# EAGLE design Magic_PCB_Pro_Micro (EAGLE 9.6.2)
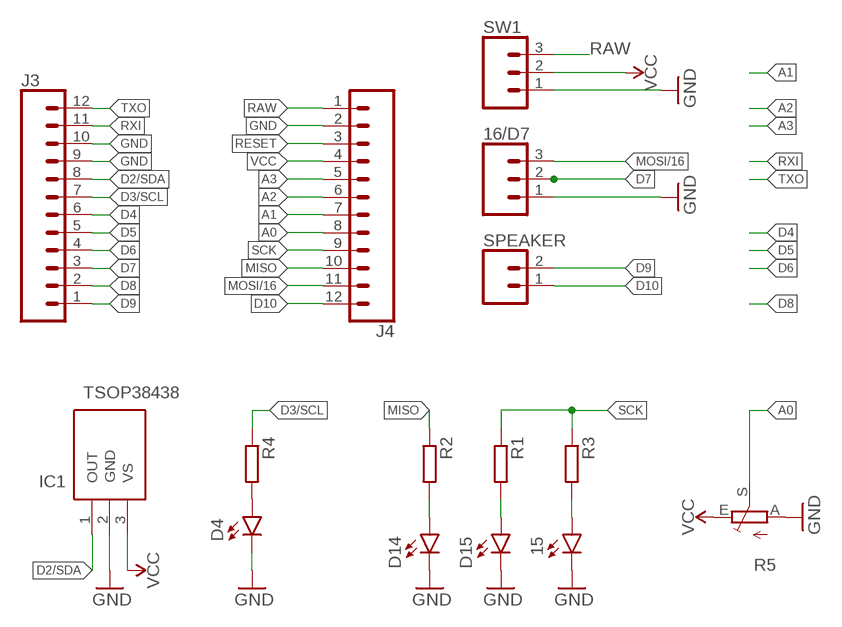
[diagram p0: schematic, sheet 1]

## Parts
15  GREEN  LEDSFH482  [SFH482]
16/D7  CONN_03  [1X03]
D4  GREEN  LEDSFH482  [SFH482]
D14  GREEN  LEDSFH482  [SFH482]
D15  Yellow  LEDSFH482  [SFH482]
IC1  TSOP38438  [TSOP38238]
J3  CONN_12LONGPADS  [1X12_LONGPADS]
J4  CONN_12LONGPADS  [1X12_LONGPADS]
R1  160  R-EU_R3216W  [R3216W]
R2  160  R-EU_R3216W  [R3216W]
R3  160  R-EU_R3216W  [R3216W]
R4  68  R-EU_R3216W  [R3216W]
R5  TRIM_EU-S64W  [S64W]
SPEAKER  CONN_02  [1X02]
SW1  CONN_03  [1X03]

## Nets
A0: J4.8 R5.S
A1: J4.7
A2: J4.6
A3: J4.5
D2/SDA: IC1.1(OUT) J3.8
D3/SCL: J3.7 R4.1
D4: J3.6
D5: J3.5
D6: J3.4
D7: 16/D7.2 J3.3
D8: J3.2
D9: J3.1 SPEAKER.2
D10: J4.12 SPEAKER.1
GND: 15.K(C) 16/D7.1 D4.K(C) D14.K(C) D15.K(C) IC1.2(GND) J3.9 J3.10 J4.2 R5.A SW1.1
MISO: J4.10 R2.1
MOSI/16: 16/D7.3 J4.11
N$1: D14.A R2.2
N$2: D15.A R1.2
N$3: 15.A R3.2
N$4: D4.A R4.2
RAW [vcc]: J4.1 SW1.3
RESET: J4.3
RXI: J3.11
SCK: J4.9 R1.1 R3.1
TXO: J3.12
VCC: IC1.3(VS) J4.4 R5.E SW1.2

## Library data of the parts
15 D4 D14 D15 = led:LED: LED OSRAM: - CHIPLED LG R971, LG N971, LY N971, LG Q971, LY Q971, LO R971, LY R971 LH N974, LH R974 LS Q976, LO Q976, LY Q976 LO Q996 - Hyper CHIPLED LW Q18S LB Q993, LB Q99A, LB R99A - SideLED LS A670, LO A670, LY A670, LG A670, LP A670 LB A673, LV A673, LT A673, LW A673 LH A674 LY A675 LS A676, LA A676, LO A676, LY A676, LW A676 LS A679, LY A679, LG A679 - Hyper Micro SIDELED® LS Y876, LA Y876, LO Y876, LY Y876 LT Y87S - SmartLED LW L88C, LW L88S LB L89C, LB L89S, LG L890 LS L89K, LO L89K, LY L89K LS L896, LA L896, LO L896, LY L896 - TOPLED LS T670, LO T670, LY T670, LG T670, LP T670 LSG T670, LSP T670, LSY T670, LOP T670, LYG T670 LG T671, LOG T671, LSG T671 LB T673, LV T673, LT T673, LW T673 LH T674 LS T676, LA T676, LO T676, LY T676, LB T676, LH T676, LSB T676, LW T676 LB T67C, LV T67C, LT T67C, LS T67K, LO T67K, LY T67K, LW E67C LS E67B, LA E67B, LO E67B, LY E67B, LB E67C, LV E67C, LT E67C LW T67C LS T679, LY T679, LG T679 LS T770, LO T770, LY T770, LG T770, LP T770 LB T773, LV T773, LT T773, LW T773 LH T774 LS E675, LA E675, LY E675, LS T675 LS T776, LA T776, LO T776, LY T776, LB T776 LHGB T686 LT T68C, LB T68C - Hyper Mini TOPLED® LB M676 - Mini TOPLED Santana® LG M470 LS M47K, LO M47K, LY M47K Source: http://www.osram.convergy.de LUXEON: - LUMILED® LXK2-PW12-R00, LXK2-PW12-S00, LXK2-PW14-U00, LXK2-PW14-V00 LXK2-PM12-R00, LXK2-PM12-S00, LXK2-PM14-U00 LXK2-PE12-Q00, LXK2-PE12-R00, LXK2-PE12-S00, LXK2-PE14-T00, LXK2-PE14-U00 LXK2-PB12-K00, LXK2-PB12-L00, LXK2-PB12-M00, LXK2-PB14-N00, LXK2-PB14-P00, LXK2-PB14-Q00 LXK2-PR12-L00, LXK2-PR12-M00, LXK2-PR14-Q00, LXK2-PR14-R00 LXK2-PD12-Q00, LXK2-PD12-R00, LXK2-PD12-S00 LXK2-PH12-R00, LXK2-PH12-S00 LXK2-PL12-P00, LXK2-PL12-Q00, LXK2-PL12-R00 Source: www.luxeon.com KINGBRIGHT: KA-3528ASYC Source: www.kingbright.com
16/D7 SW1 = SparkFun-Connectors:CONN_03: Multi connection point. Often used as Generic Header-pin footprint for 0.1 inch spaced/style header connections On any of the 0.1 inch spaced packages, you can populate with these: Break Away Headers - Straight <https://www.sparkfun.com/products/116> (PRT-00116) Break Away Male Headers - Right Angle <https://www.sparkfun.com/products/553> (PRT-00553) Female Headers <https://www.sparkfun.com/products/115> (PRT-00115) Break Away Headers - Machine Pin <https://www.sparkfun.com/products/117> (PRT-00117) Break Away Female Headers - Swiss Machine Pin <https://www.sparkfun.com/products/743> (PRT-00743) Stackable Header - 3 Pin (Female, 0.1") <https://www.sparkfun.com/products/13875> (PRT-13875) For SCREWTERMINALS and SPRING TERMINALS visit here: Screw Terimnals on SparkFun.com <https://www.sparkfun.com/search/results?term=Screw+Terminals> (5mm/3.5mm/2.54mm spacing) This device is also useful as a general connection point to wire up your design to another part of your project. Our various solder wires solder well into these plated through hole pads. Hook-Up Wire - Assortment (Stranded, 22 AWG) <https://www.sparkfun.com/products/11375> (PRT-11375) Hook-Up Wire - Assortment (Solid Core, 22 AWG) <https://www.sparkfun.com/products/11367> (PRT-11367) View the entire wire category on our website here <https://www.sparkfun.com/categories/141> Special notes: Molex polarized connector foot print use with SKU : PRT-08232 with associated crimp pins and housings.
IC1 = TSOP38438:TSOP38438: IR Remote Receiver 38KHz 45m Source: Datasheet <http://www.vishay.com/docs/82491/tsop382.pdf>; ARROW_PART_NUMBER: TSOP38438; ARROW_PRICE-STOCK: https://www.arrow.com/en/products/tsop38438/vishay?region=nac; DESCRIPTION: IR Remote Receiver 38KHz 45m; HEIGHT: mm; MANUFACTURER_NAME: Vishay; MANUFACTURER_PART_NUMBER: TSOP38438; MOUSER_PART_NUMBER: 78-TSOP38438; MOUSER_PRICE-STOCK: https://www.mouser.co.uk/ProductDetail/Vishay-Semiconductors/TSOP38438/?qs=fbkhFuCHoTaKUNuf%2Fea2zA%3D%3D
J3 J4 = Castellated:CONN_12: Multi connection point. Often used as Generic Header-pin footprint for 0.1 inch spaced/style header connections On any of the 0.1 inch spaced packages, you can populate with these: Break Away Headers - Straight <https://www.sparkfun.com/products/116> (PRT-00116) Break Away Male Headers - Right Angle <https://www.sparkfun.com/products/553> (PRT-00553) Female Headers <https://www.sparkfun.com/products/115> (PRT-00115) Break Away Headers - Machine Pin <https://www.sparkfun.com/products/117> (PRT-00117) Break Away Female Headers - Swiss Machine Pin <https://www.sparkfun.com/products/743> (PRT-00743) For SCREWTERMINALS and SPRING TERMINALS visit here: Screw Terimnals on SparkFun.com <https://www.sparkfun.com/search/results?term=Screw+Terminals> (5mm/3.5mm/2.54mm spacing) This device is also useful as a general connection point to wire up your design to another part of your project. Our various solder wires solder well into these plated through hole pads. Hook-Up Wire - Assortment (Stranded, 22 AWG) <https://www.sparkfun.com/products/11375> (PRT-11375) Hook-Up Wire - Assortment (Solid Core, 22 AWG) <https://www.sparkfun.com/products/11367> (PRT-11367) View the entire wire category on our website here <https://www.sparkfun.com/categories/141> Special notes: Molex polarized connector foot print use with SKU : PRT-08231 with associated crimp pins and housings. 1MM SMD Version SKU: PRT-10208 NOTES ON THE VARIANTS LOCK and LOCK_LONGPADS... This footprint was designed to help hold the alignment of a through-hole component (i.e. 6-pin header) while soldering it into place. You may notice that each hole has been shifted either up or down by 0.005 of an inch from it's more standard position (which is a perfectly straight line). This slight alteration caused the pins (the squares in the middle) to touch the edges of the holes. Because they are alternating, it causes a "brace" to hold the component in place. 0.005 has proven to be the perfect amount of "off-center" position when using our standard breakaway headers. Although looks a little odd when you look at the bare footprint, once you have a header in there, the alteration is very hard to notice. Also,if you push a header all the way into place, it is covered up entirely on the bottom side.
R1-R4 = rcl:R-EU_: RESISTOR, European symbol; SPICEPREFIX: R
R5 = pot:TRIM_EU-: POTENTIOMETER
SPEAKER = SparkFun-Connectors:CONN_02: Multi connection point. Often used as Generic Header-pin footprint for 0.1 inch spaced/style header connections On any of the 0.1 inch spaced packages, you can populate with these: Break Away Headers - Straight <https://www.sparkfun.com/products/116> (PRT-00116) Break Away Male Headers - Right Angle <https://www.sparkfun.com/products/553> (PRT-00553) Female Headers <https://www.sparkfun.com/products/115> (PRT-00115) Break Away Headers - Machine Pin <https://www.sparkfun.com/products/117> (PRT-00117) Break Away Female Headers - Swiss Machine Pin <https://www.sparkfun.com/products/743> (PRT-00743) For SCREWTERMINALS and SPRING TERMINALS visit here: Screw Terimnals on SparkFun.com <https://www.sparkfun.com/search/results?term=Screw+Terminals> (5mm/3.5mm/2.54mm spacing) This device is also useful as a general connection point to wire up your design to another part of your project. Our various solder wires solder well into these plated through hole pads. Hook-Up Wire - Assortment (Stranded, 22 AWG) <https://www.sparkfun.com/products/11375> (PRT-11375) Hook-Up Wire - Assortment (Solid Core, 22 AWG) <https://www.sparkfun.com/products/11367> (PRT-11367) View the entire wire category on our website here <https://www.sparkfun.com/categories/141> Special notes: Molex polarized connector foot print use with: PRT-08233 with associated crimp pins and housings. 2.54_SCREWTERM for use with PRT-10571. 3.5mm Screw Terminal footprints for PRT-08084 5mm Screw Terminal footprints for use with PRT-08432

## Board
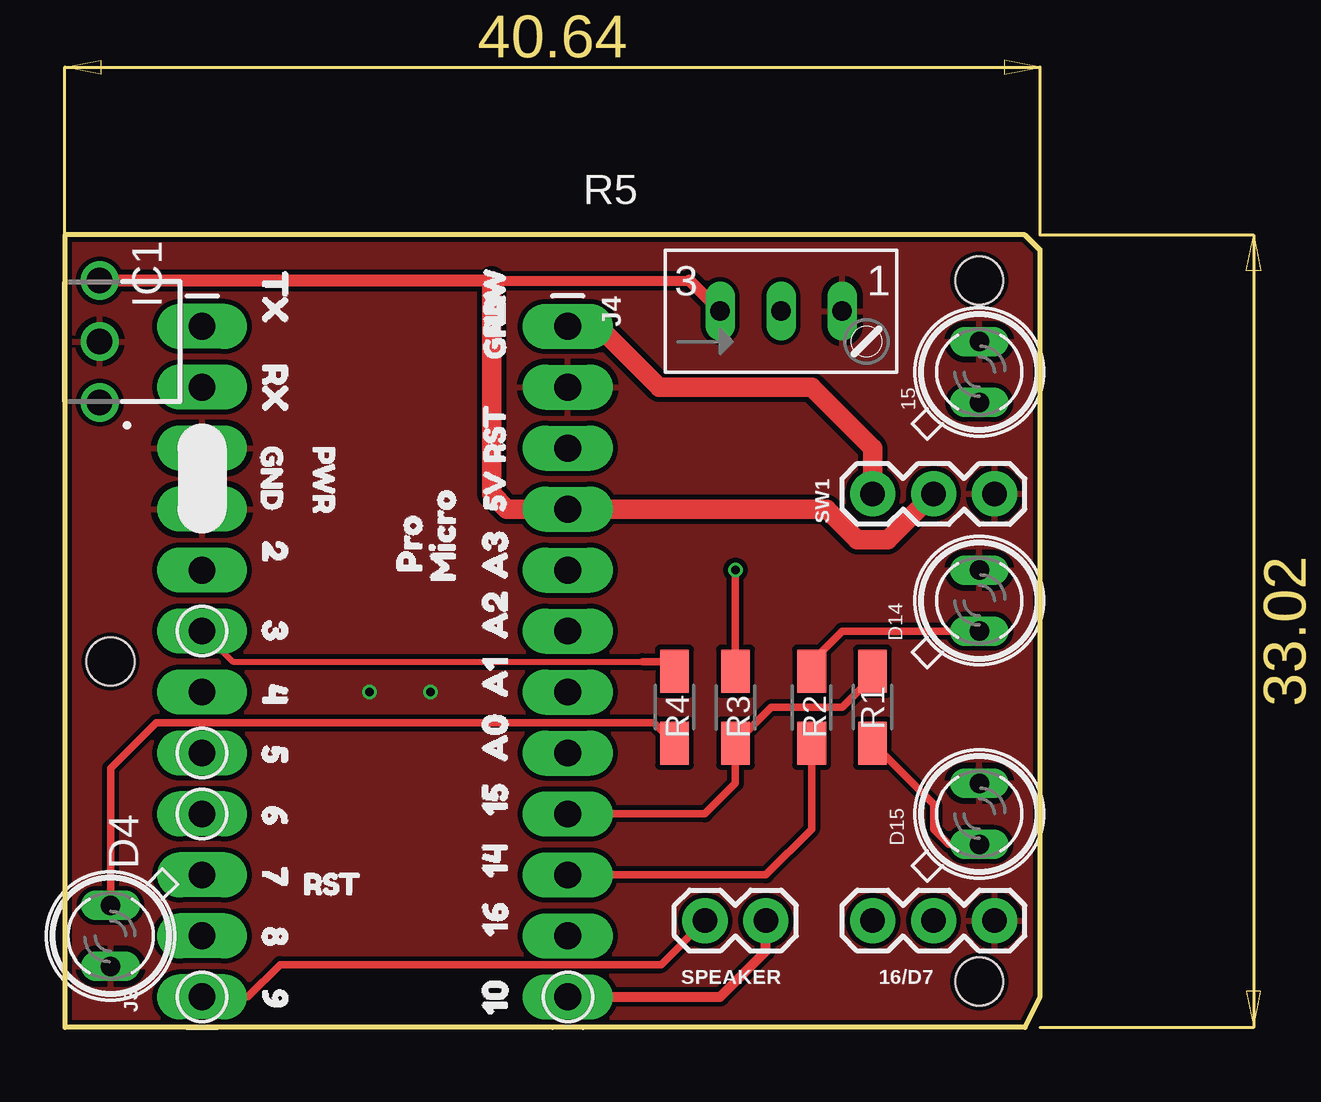
[diagram p1: board, top side]
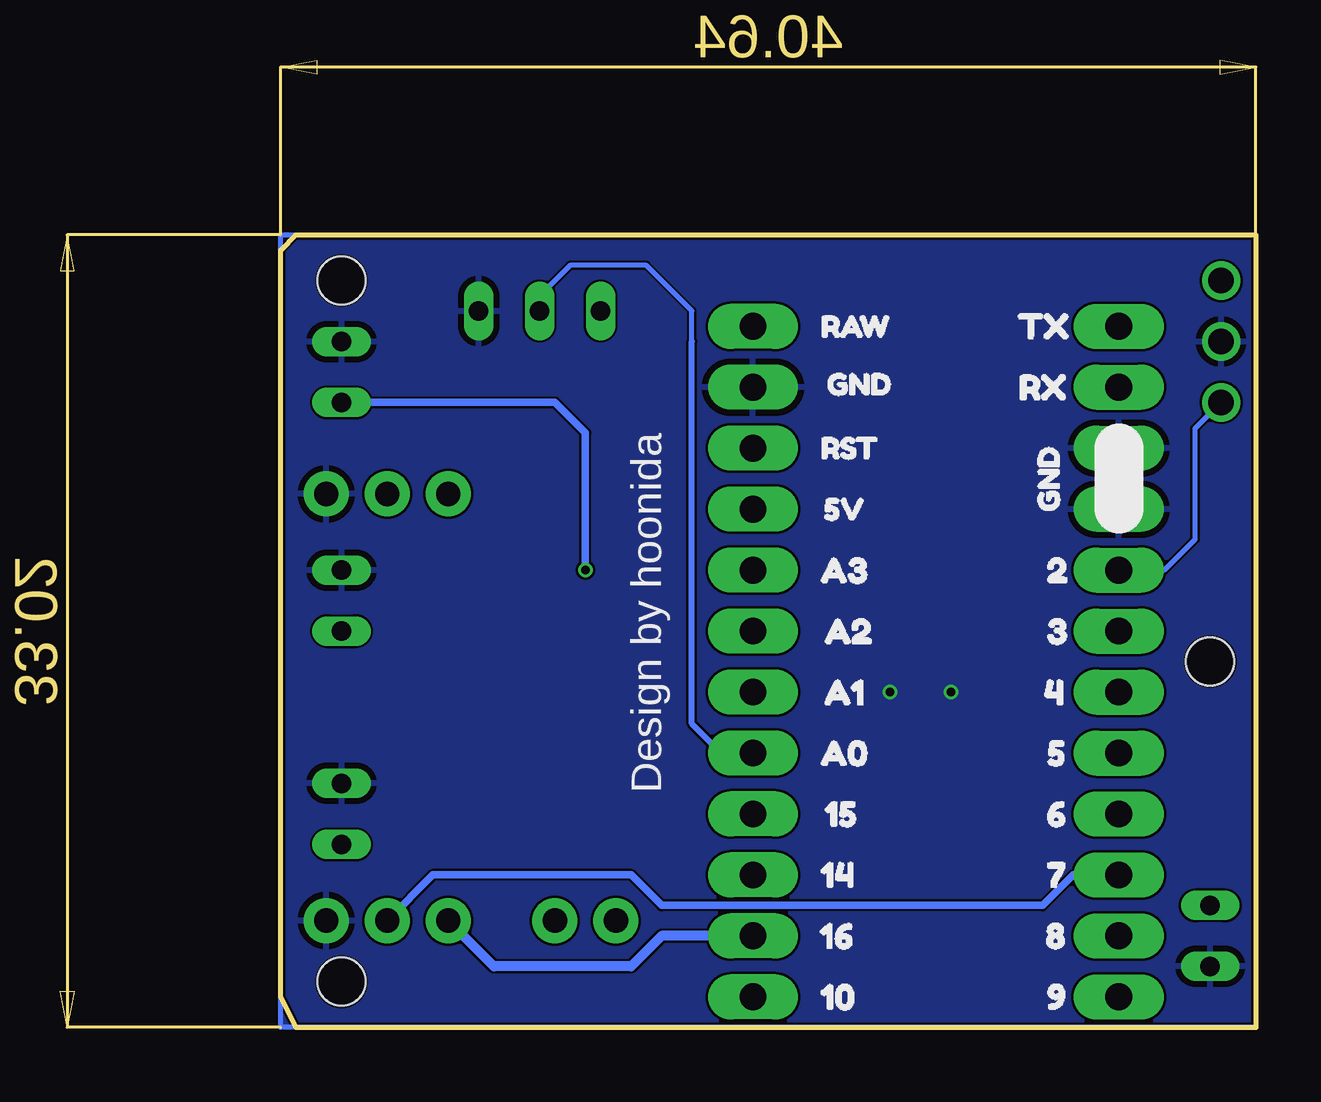
[diagram p2: board, bottom side, seen from below]

Size 40.64 x 33.02 mm. Coordinates in mm from the lower left corner, seen from the top.
Outline: 0,33.02 0,0 40.01,0 40.64,1.27 40.64,32.38 40.01,33.02 0,33.02
Copper layers (1*16): Top 0.035mm / dielectric 1.5mm / Bottom 0.035mm
Design rules "SparkFun-2-layer-FAB-LIMIT": minimum track width 4mil, minimum drill 6mil, track to track 4mil, track to pad 4mil, pad to pad 4mil, via to via 4mil, smd to smd 4mil, copper to edge 4mil, drill to drill 4mil, minimum pad ring 5mil, minimum via ring 5mil, stop-mask expansion 4mil, vias tented up to drill 25mil, thermal gap 10mil
Holes 2 mm at 1.91,15.24 38.1,31.11 38.1,1.91

### Footprints (pad centres in the part's own frame; a part is rotated, then mirrored left to right if it is on the bottom)
SFH482 = drill 0.813 long: A -1.27,0; K 1.27,0
1X03 = drill 1.016 pad 1.88: 1 0,0; 2 2.54,0; 3 5.08,0
TSOP38238 = drill 1.06 pad 1.56: 1 -2.54,-1.45; 2 0,-1.45; 3 2.54,-1.45
1X12_LONGPADS = drill 1.118 pad 1.88 long: 1 0,0; 2 2.54,0; 3 5.08,0; 4 7.62,0; 5 10.16,0; 6 12.7,0; 7 15.24,0; 8 17.78,0; 9 20.32,0; 10 22.86,0; 11 25.4,0; 12 27.94,0
R3216W = smd 1.8 x 1.2: 1 -1.499,0; 2 1.499,0
S64W = drill 0.813 long: A 2.54,1.27; E -2.54,1.27; S 0,1.27
1X02 = drill 1.016 pad 1.88: 1 0,0; 2 2.54,0

### Placement (x,y rotation side)
15  38.1,27.3 90 top
16/D7  38.73,4.45 180 top
D4  1.91,3.81 270 top
D14  38.1,17.78 90 top
D15  38.1,8.89 90 top
IC1  0,28.57 90 top
J3  5.71,1.27 90 top
J4  20.96,29.21 270 top
R1  33.66,13.34 270 top
R2  31.12,13.34 90 top
R3  27.94,13.34 90 top
R4  25.4,13.34 270 top
R5  29.84,28.57 0 top
SPEAKER  29.21,4.45 180 top
SW1  38.73,22.23 180 top
U$2  [156]  17.91,7.75 90 top
U$4  [164]  17.91,2.92 90 top
U$5  [218]  8.76,21.34 270 top
U$6  [317]  8.76,18.03 270 top
U$7  [515]  8.76,12.83 270 top
U$8  [614]  8.76,10.29 270 top
U$9  [713]  8.76,7.75 270 top
U$10  [812]  8.76,5.08 270 top
U$11  [GND4]  8.64,25.15 270 top
U$12  [RAW5]  17.91,27.94 90 top
U$13  [45]  8.76,15.37 270 top
U$16  [911]  8.76,2.67 270 top
U$17  [A07]  17.91,10.16 90 top
U$18  [TX2]  8.76,32.38 270 top
U$19  [A18]  17.91,12.7 90 top
U$21  [104]  17.91,-0.38 90 top
U$22  [GND4]  17.91,26.92 90 top
U$23  [MICRO1]  15.75,17.65 90 top
U$24  [PRO0]  14.35,18.03 90 top
U$25  [RST3]  9.14,5.97 0 top
U$26  [A29]  17.91,15.11 90 top
U$27  [A310]  17.91,17.78 90 top
U$28  [RX20]  8.76,28.57 270 top
U$29  [145]  17.91,5.33 90 top
U$31  [RST3]  17.91,22.73 90 top
U$32  [GND4]  18.8,26.8 0 bottom
U$34  [A310]  19.05,19.05 0 bottom
U$35  [A29]  19.05,16.51 0 bottom
U$36  [A18]  19.05,13.97 0 bottom
U$37  [A07]  19.05,11.43 0 bottom
U$38  [156]  19.05,8.89 0 bottom
U$41  [RST3]  18.92,24.13 0 bottom
U$46  [RAW5]  18.92,29.21 0 bottom
U$47  [145]  19.05,6.35 0 bottom
U$48  [164]  19.05,3.81 0 bottom
U$49  [104]  19.05,1.27 0 bottom
U$50  [911]  9.78,1.27 0 bottom
U$51  [812]  9.65,3.81 0 bottom
U$52  [713]  9.78,6.35 0 bottom
U$53  [614]  9.78,8.89 0 bottom
U$54  [515]  9.78,11.43 0 bottom
U$55  [45]  9.91,13.97 0 bottom
U$56  [317]  9.78,16.51 0 bottom
U$57  [218]  9.78,19.05 0 bottom
U$58  [GND4]  8.64,20.57 90 bottom
U$59  [RX20]  10.79,26.67 0 bottom
U$60  [TX2]  10.79,29.21 0 bottom
U$63  [PWR0]  10.79,25.02 270 top
U$64  [5V1]  18.8,21.59 0 bottom
U$65  [5V1]  17.91,20.7 90 top

### Tracks (layer width: path | path; a pad name or v marks a point on that pad's centre or on a via)
A0
  Bottom 0.2: 23.5,28.58 23.5,29.85 25.4,31.75 28.57,31.75 29.84,30.48 R5.S
  Bottom 0.254: J4.8 22.28,11.43 23.5,12.65 23.5,28.58
A2
  Top 0.152: 20.75,16.31 J4.6
D2/SDA
  Bottom 0.203: IC1.1 2.54,24.95 2.54,20.32 3.81,19.05 J3.8
D3/SCL
  Top 0.254: J3.7 6.99,15.24 24.07,15.24
  Top 0.305: 24.07,15.24 24.99,15.24 R4.1
D7
  Bottom 0.305: J3.3 7.62,6.35 8.89,5.08 24.77,5.08 26.04,6.35 34.29,6.35 16/D7.2
D9
  Top 0.305: J3.1 7.62,1.27 8.97,2.62 24.84,2.62 SPEAKER.2
D10
  Top 0.406: J4.12 27.3,1.27 29.21,3.17 SPEAKER.1
GND  (via drill 0.35)
  Bottom 0.203: 0,33.02 0,0 40.64,0 40.64,33.02 0,33.02
  Bottom 1.016: J3.10 6.99,24.13
  other vias: 12.7,13.97 15.24,13.97
  pour Top (isolate 0.203): 0,33.02 40.64,33.02 40.64,0 0,0
  pour Bottom (isolate 0.203): 0,33.02 40.64,33.02 40.64,0 0,0
  pour Bottom: 0,33.02 0,0 40.64,0 40.64,33.02
  pour Bottom: 40.64,0 0,0 0,33.02 40.64,33.02
  pour Bottom: 0,33.02 0,0 40.64,0 40.64,33.02
MISO
  Top 0.305: R2.1 31.12,8.26 29.21,6.35 J4.10
MOSI/16
  Bottom 0.406: J4.11 24.77,3.81 26.04,2.54 31.75,2.54 16/D7.3
N$1
  Top 0.305: D14.A 32.39,16.51 31.12,15.24 R2.2
N$2
  Top 0.305: R1.2 36.2,9.3 36.2,8.26 36.83,7.62 D15.A
N$3  (via drill 0.35)
  Top 0.305: R3.2 v27.94,19.05
  Bottom 0.305: 15.A 29.21,26.04 27.94,24.77 v27.94,19.05
N$4
  Top 0.254: 25.32,11.92 R4.2
  Top 0.305: D4.A 1.91,10.79 3.81,12.7 24.54,12.7 25.32,11.92
RAW
  Top 0.813: J4.1 22.23,29.21 24.77,26.67 31.12,26.67 33.66,24.13 SW1.3
SCK
  Top 0.305: R1.1 33.66,14.61 32.39,13.34 29.44,13.34 R3.1 27.94,10.16 26.67,8.89 J4.9
VCC
  Top 0.406: 17.78,31.11 26.04,31.11
  Top 0.508: 17.78,31.11 IC1.3 | 26.04,31.11 R5.E
  Top 0.813: 17.78,31.11 17.78,22.23 18.41,21.59 J4.4 31.75,21.59 33.02,20.32 34.29,20.32 SW1.2

### Text on the board
bPlace: Design by hoonida
tDocu: 0.5mm PCB